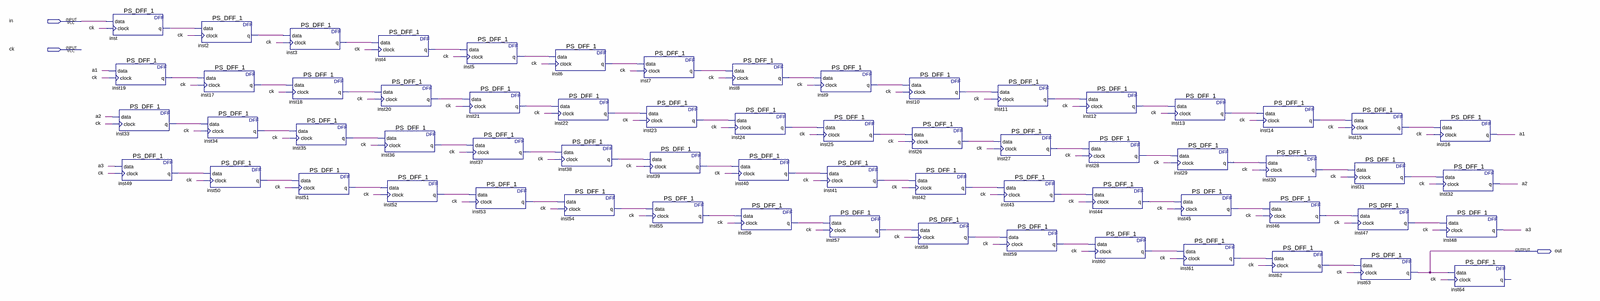
[diagram p0: schematic sheet, whole]
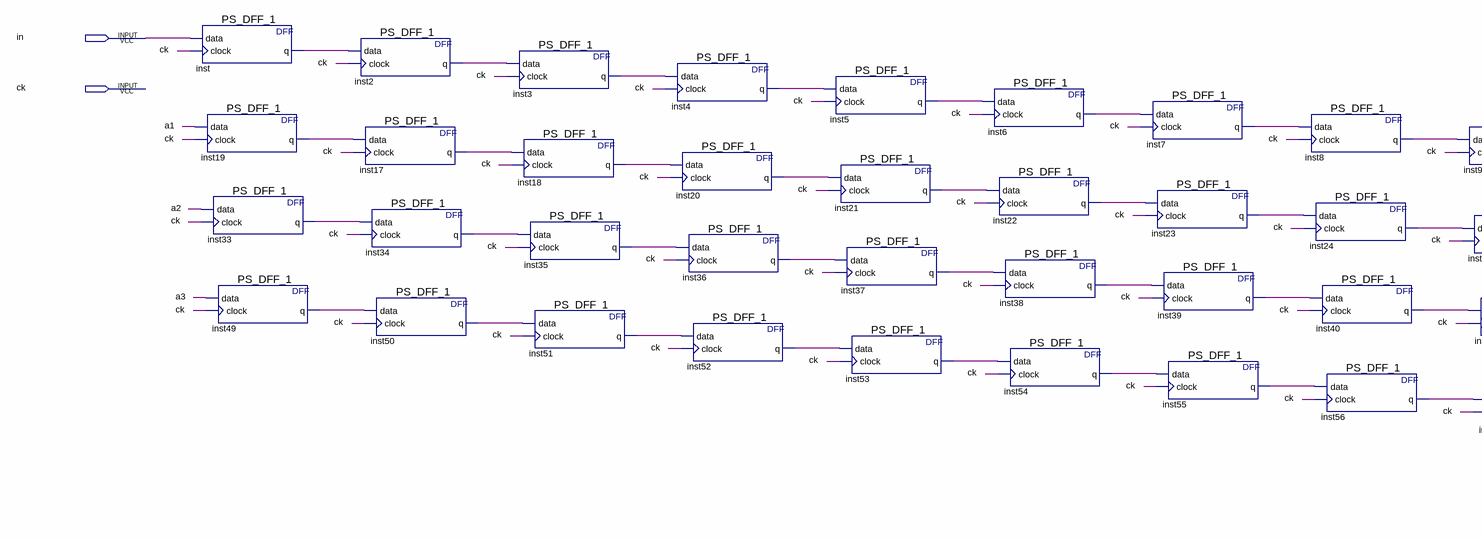
[diagram p1: schematic sheet, left part]
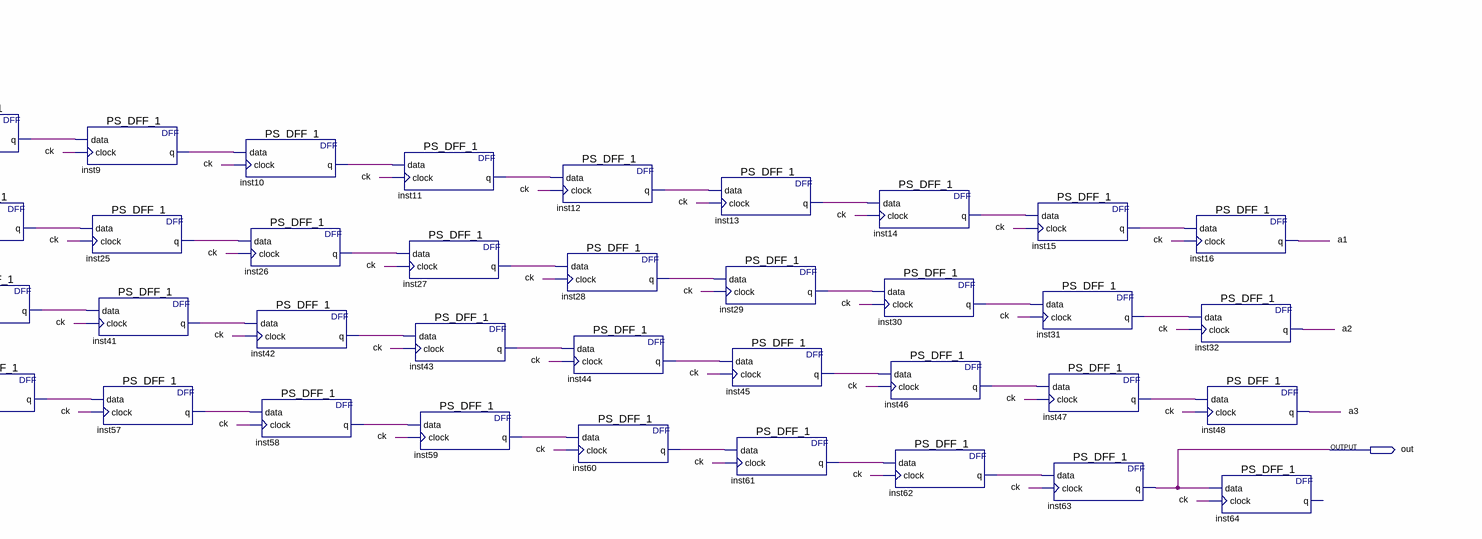
[diagram p2: schematic sheet, right part]
// Quartus schematic PS_DFF_1x64.bdf as structural Verilog: 64 symbols, 3 pins
module PS_DFF_1x64 (
  input  in,
  input  ck,
  output out
);

  wire a1, a2, a3, inst2_q, inst3_q, inst4_q, inst5_q, inst6_q, inst7_q, inst8_q, inst9_q, inst10_q,
       inst11_q, inst12_q, inst13_q, inst14_q, inst15_q, inst17_q, inst18_q, inst19_q, inst20_q, inst21_q,
       inst22_q, inst23_q, inst24_q, inst25_q, inst26_q, inst27_q, inst28_q, inst29_q, inst30_q, inst31_q,
       inst33_q, inst34_q, inst35_q, inst36_q, inst37_q, inst38_q, inst39_q, inst40_q, inst41_q, inst42_q,
       inst43_q, inst44_q, inst45_q, inst46_q, inst47_q, inst49_q, inst50_q, inst51_q, inst52_q, inst53_q,
       inst54_q, inst55_q, inst56_q, inst57_q, inst58_q, inst59_q, inst60_q, inst61_q, inst62_q, inst_q;

  PS_DFF_1 inst (.data(in), .clock(ck), .q(inst_q));
  PS_DFF_1 inst19 (.data(a1), .clock(ck), .q(inst19_q));
  PS_DFF_1 inst33 (.data(a2), .clock(ck), .q(inst33_q));
  PS_DFF_1 inst49 (.data(a3), .clock(ck), .q(inst49_q));
  PS_DFF_1 inst2 (.data(inst_q), .clock(ck), .q(inst2_q));
  PS_DFF_1 inst17 (.data(inst19_q), .clock(ck), .q(inst17_q));
  PS_DFF_1 inst34 (.data(inst33_q), .clock(ck), .q(inst34_q));
  PS_DFF_1 inst50 (.data(inst49_q), .clock(ck), .q(inst50_q));
  PS_DFF_1 inst3 (.data(inst2_q), .clock(ck), .q(inst3_q));
  PS_DFF_1 inst18 (.data(inst17_q), .clock(ck), .q(inst18_q));
  PS_DFF_1 inst35 (.data(inst34_q), .clock(ck), .q(inst35_q));
  PS_DFF_1 inst51 (.data(inst50_q), .clock(ck), .q(inst51_q));
  PS_DFF_1 inst4 (.data(inst3_q), .clock(ck), .q(inst4_q));
  PS_DFF_1 inst20 (.data(inst18_q), .clock(ck), .q(inst20_q));
  PS_DFF_1 inst36 (.data(inst35_q), .clock(ck), .q(inst36_q));
  PS_DFF_1 inst52 (.data(inst51_q), .clock(ck), .q(inst52_q));
  PS_DFF_1 inst5 (.data(inst4_q), .clock(ck), .q(inst5_q));
  PS_DFF_1 inst21 (.data(inst20_q), .clock(ck), .q(inst21_q));
  PS_DFF_1 inst37 (.data(inst36_q), .clock(ck), .q(inst37_q));
  PS_DFF_1 inst53 (.data(inst52_q), .clock(ck), .q(inst53_q));
  PS_DFF_1 inst6 (.data(inst5_q), .clock(ck), .q(inst6_q));
  PS_DFF_1 inst22 (.data(inst21_q), .clock(ck), .q(inst22_q));
  PS_DFF_1 inst38 (.data(inst37_q), .clock(ck), .q(inst38_q));
  PS_DFF_1 inst54 (.data(inst53_q), .clock(ck), .q(inst54_q));
  PS_DFF_1 inst7 (.data(inst6_q), .clock(ck), .q(inst7_q));
  PS_DFF_1 inst23 (.data(inst22_q), .clock(ck), .q(inst23_q));
  PS_DFF_1 inst39 (.data(inst38_q), .clock(ck), .q(inst39_q));
  PS_DFF_1 inst55 (.data(inst54_q), .clock(ck), .q(inst55_q));
  PS_DFF_1 inst8 (.data(inst7_q), .clock(ck), .q(inst8_q));
  PS_DFF_1 inst24 (.data(inst23_q), .clock(ck), .q(inst24_q));
  PS_DFF_1 inst40 (.data(inst39_q), .clock(ck), .q(inst40_q));
  PS_DFF_1 inst56 (.data(inst55_q), .clock(ck), .q(inst56_q));
  PS_DFF_1 inst9 (.data(inst8_q), .clock(ck), .q(inst9_q));
  PS_DFF_1 inst25 (.data(inst24_q), .clock(ck), .q(inst25_q));
  PS_DFF_1 inst41 (.data(inst40_q), .clock(ck), .q(inst41_q));
  PS_DFF_1 inst57 (.data(inst56_q), .clock(ck), .q(inst57_q));
  PS_DFF_1 inst10 (.data(inst9_q), .clock(ck), .q(inst10_q));
  PS_DFF_1 inst26 (.data(inst25_q), .clock(ck), .q(inst26_q));
  PS_DFF_1 inst42 (.data(inst41_q), .clock(ck), .q(inst42_q));
  PS_DFF_1 inst58 (.data(inst57_q), .clock(ck), .q(inst58_q));
  PS_DFF_1 inst11 (.data(inst10_q), .clock(ck), .q(inst11_q));
  PS_DFF_1 inst27 (.data(inst26_q), .clock(ck), .q(inst27_q));
  PS_DFF_1 inst43 (.data(inst42_q), .clock(ck), .q(inst43_q));
  PS_DFF_1 inst59 (.data(inst58_q), .clock(ck), .q(inst59_q));
  PS_DFF_1 inst12 (.data(inst11_q), .clock(ck), .q(inst12_q));
  PS_DFF_1 inst28 (.data(inst27_q), .clock(ck), .q(inst28_q));
  PS_DFF_1 inst44 (.data(inst43_q), .clock(ck), .q(inst44_q));
  PS_DFF_1 inst60 (.data(inst59_q), .clock(ck), .q(inst60_q));
  PS_DFF_1 inst13 (.data(inst12_q), .clock(ck), .q(inst13_q));
  PS_DFF_1 inst29 (.data(inst28_q), .clock(ck), .q(inst29_q));
  PS_DFF_1 inst45 (.data(inst44_q), .clock(ck), .q(inst45_q));
  PS_DFF_1 inst61 (.data(inst60_q), .clock(ck), .q(inst61_q));
  PS_DFF_1 inst14 (.data(inst13_q), .clock(ck), .q(inst14_q));
  PS_DFF_1 inst30 (.data(inst29_q), .clock(ck), .q(inst30_q));
  PS_DFF_1 inst46 (.data(inst45_q), .clock(ck), .q(inst46_q));
  PS_DFF_1 inst62 (.data(inst61_q), .clock(ck), .q(inst62_q));
  PS_DFF_1 inst15 (.data(inst14_q), .clock(ck), .q(inst15_q));
  PS_DFF_1 inst31 (.data(inst30_q), .clock(ck), .q(inst31_q));
  PS_DFF_1 inst47 (.data(inst46_q), .clock(ck), .q(inst47_q));
  PS_DFF_1 inst63 (.data(inst62_q), .clock(ck), .q(out));
  PS_DFF_1 inst16 (.data(inst15_q), .clock(ck), .q(a1));
  PS_DFF_1 inst32 (.data(inst31_q), .clock(ck), .q(a2));
  PS_DFF_1 inst48 (.data(inst47_q), .clock(ck), .q(a3));
  PS_DFF_1 inst64 (.data(out), .clock(ck));  // open: q
endmodule
